# EasyEDA Pro project 第二版-FD6288Q-V1.0.epro, schematic Schematic1
Board Name: Board1; Create Date: 2025-09-24; Page Name: P1; Project Name: FOC第二版-FD6288Q-V1.0; Schematic Name: Schematic1; Update Date: 2025-09-27; BladeWidth: 10; Company: 嘉立创EDA; Page Size: A4; RegionStart: 1; ShowBorder: 1; TitleBlock: 1; TitleBlockPosition: 3; Version: V1.0; XRegionCount: 6; YRegionCount: 4
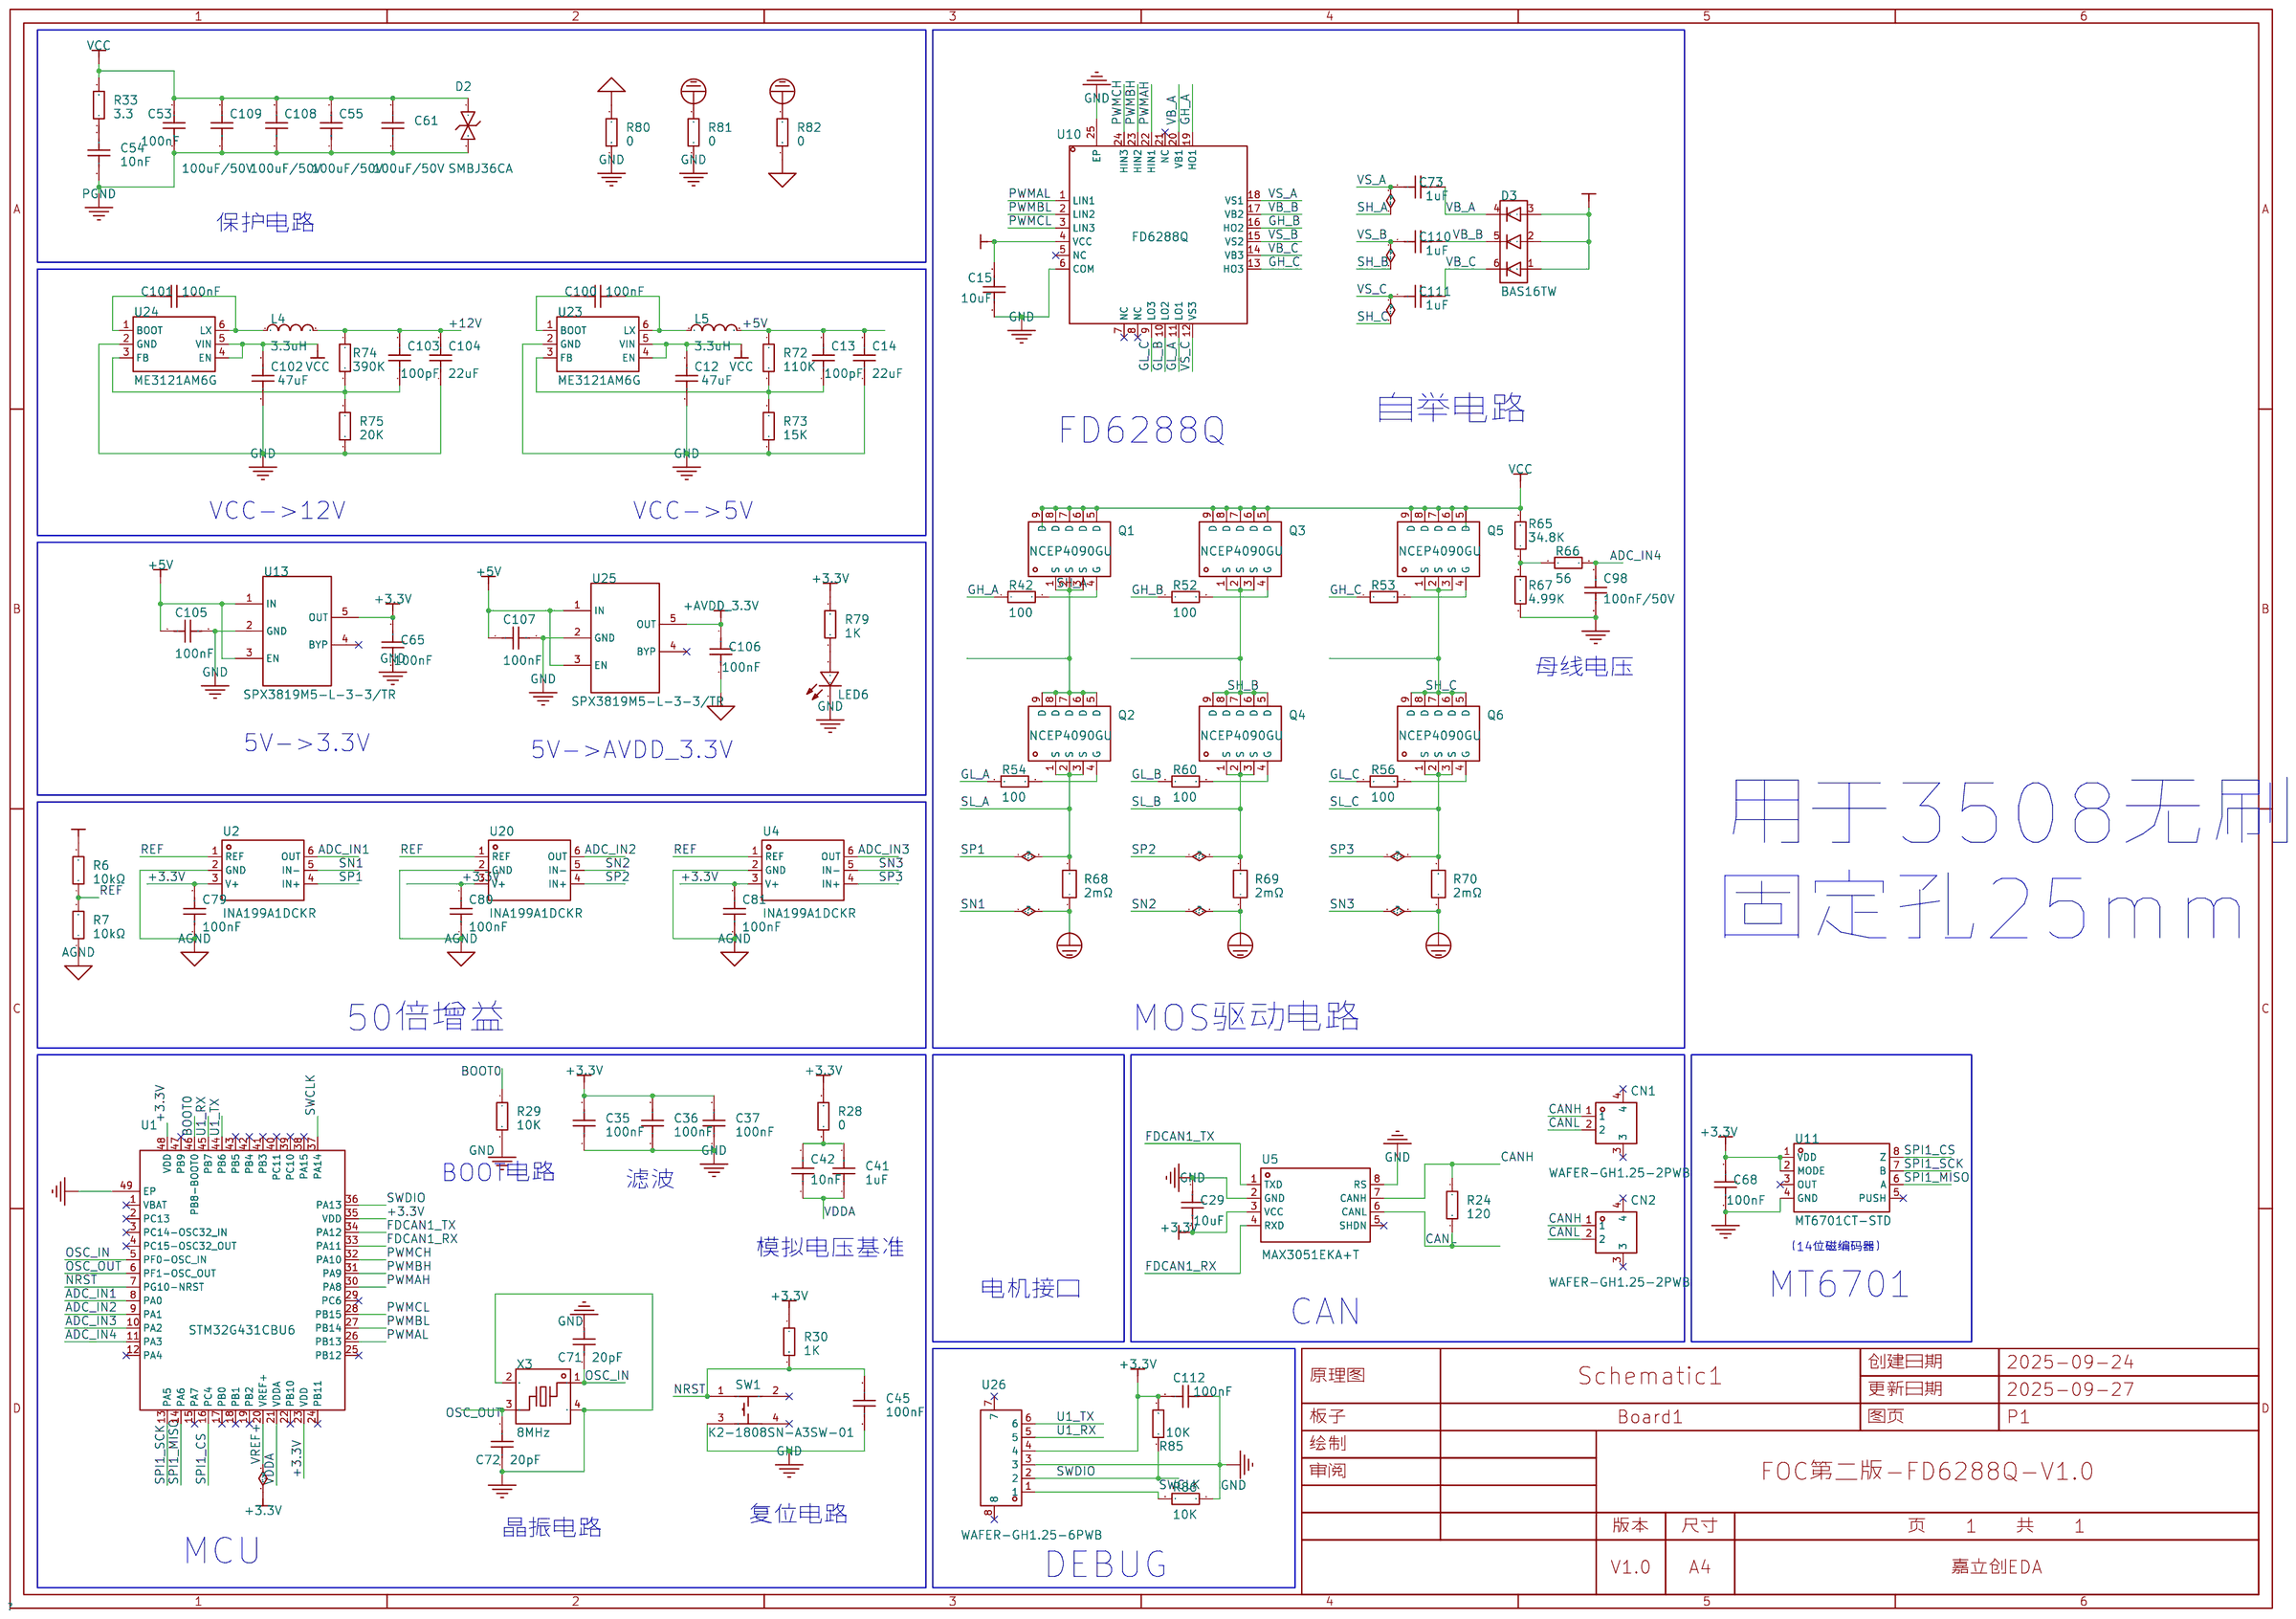
[diagram p0: schematic sheet]

## Parts
C12  47uF  [C1206]
C13  100pF  [C0603]
C14  22uF  [C0805]
C15  10uF  [C0603]
C29  10uF  [C0603]
C35  100nF  [C0603]
C36  100nF  [C0603]
C37  100nF  [C0603]
C41  1uF  [C0603]
C42  10nF  [C0603]
C45  100nF  [C0603]
C53  100nF  [C0603]
C54  10nF  [C0603]
C55  100uF/50V  [C1206]
C61  100uF/50V  [C1206]
C65  100nF  [C0603]
C68  100nF  [C0603]
C71  20pF  [C0603]
C72  20pF  [C0603]
C73  1uF  [C0603]
C79  100nF  [C0603]
C80  100nF  [C0603]
C81  100nF  [C0603]
C98  100nF/50V  [C0603]
C100  100nF  [C0603]
C101  100nF  [C0603]
C102  47uF  [C1206]
C103  100pF  [C0603]
C104  22uF  [C0805]
C105  100nF  [C0603]
C106  100nF  [C0603]
C107  100nF  [C0603]
C108  100uF/50V  [C1206]
C109  100uF/50V  [C1206]
C110  1uF  [C0603]
C111  1uF  [C0603]
C112  100nF  [C0603]
CN1  WAFER-GH1.25-2PWB  [CONN-TH_2P-P1.25_XUNPU_WAFER-GH1.25-2PWB]
CN2  WAFER-GH1.25-2PWB  [CONN-TH_2P-P1.25_XUNPU_WAFER-GH1.25-2PWB]
D2  SMBJ36CA  [SMB_L4.4-W3.6-LS5.3-BI]
D3  BAS16TW  [SOT-363_L2.1-W1.3-P0.65-LS2.3-BL]
L4  3.3uH  [IND-SMD_L4.4-W4.2-A]
L5  3.3uH  [IND-SMD_L4.4-W4.2-A]
LED6  KT-0603R  [LED0603-RD]
Q1  NCEP4090GU  [PDFN-8_L5.8-W5.1-P1.27-LS6.1-BL]
Q2  NCEP4090GU  [PDFN-8_L5.8-W5.1-P1.27-LS6.1-BL]
Q3  NCEP4090GU  [PDFN-8_L5.8-W5.1-P1.27-LS6.1-BL]
Q4  NCEP4090GU  [PDFN-8_L5.8-W5.1-P1.27-LS6.1-BL]
Q5  NCEP4090GU  [PDFN-8_L5.8-W5.1-P1.27-LS6.1-BL]
Q6  NCEP4090GU  [PDFN-8_L5.8-W5.1-P1.27-LS6.1-BL]
R6  10kΩ  [R0603]
R7  10kΩ  [R0603]
R24  120  [R0603]
R28  0  [R0603]
R29  10K  [R0603]
R30  1K  [R0603]
R33  3.3  [R0603]
R42  100  [R0603]
R52  100  [R0603]
R53  100  [R0603]
R54  100  [R0603]
R56  100  [R0603]
R60  100  [R0603]
R65  34.8K  [R0603]
R66  56  [R0603]
R67  4.99K  [R0603]
R68  2mΩ  [R1206]
R69  2mΩ  [R1206]
R70  2mΩ  [R1206]
R72  110K  [R0603]
R73  15K  [R0603]
R74  390K  [R0603]
R75  20K  [R0603]
R79  1K  [R0603]
R80  0  [R0603]
R81  0  [R0603]
R82  0  [R0603]
R85  10K  [R0603]
R86  10K  [R0603]
SW1  K2-1808SN-A3SW-01  [SW-SMD_4P-L4.2-W3.3-P2.15-LS5.1]
U1  STM32G431CBU6  [VQFN-48_L7.0-W7.0-P0.50-BL-EP5.5]
U2  INA199A1DCKR  [SC-70-6_L2.2-W1.3-P0.65-LS2.1-BR]
U4  INA199A1DCKR  [SC-70-6_L2.2-W1.3-P0.65-LS2.1-BR]
U5  MAX3051EKA+T  [SOT-23-8_L3.0-W1.7-P0.65-LS2.8-TL]
U10  FD6288Q  [QFN-24_L4.0-W4.0-P0.50-BL-EP2.6]
U11  MT6701CT-STD  [SOP-8_L4.9-W3.9-P1.27-LS6.0-BL]
U13  SPX3819M5-L-3-3/TR  [SOT-23-5_L3.0-W1.7-P0.95-LS2.8-BL]
U20  INA199A1DCKR  [SC-70-6_L2.2-W1.3-P0.65-LS2.1-BR]
U23  ME3121AM6G  [SOT-23-6_L2.9-W1.6-P0.95-LS2.8-BR]
U24  ME3121AM6G  [SOT-23-6_L2.9-W1.6-P0.95-LS2.8-BR]
U25  SPX3819M5-L-3-3/TR  [SOT-23-5_L3.0-W1.7-P0.95-LS2.8-BL]
U26  WAFER-GH1.25-6PWB  [CONN-SMD_6P-P1.25_XUNPU_WAFER-GH1.25-6PWB]
X3  8MHz  [CRYSTAL-SMD_4P-L3.2-W2.5-BL]

## Library data of the parts
C12 C55 C61 C102 C108 C109 = CAP_1206: Supplier Footprint: 1206
C13 C15 C29 C35-C37 C41 C42 C45 C53 C54 C65 C68 C71-C73 C79-C81 C98 C100 C101 C103 C105-C107 C110-C112 = CAP_0603: Supplier Footprint: 0603
C14 C104 = CAP_0805: Supplier Footprint: 0805
CN1 CN2 = WAFER-GH1.25-2PWB: 插针结构:1x2P;间距:1.25mm;安装方式:卧贴;参考系列:GH;总PIN数:2P;排数:1;每排PIN数:2;行距:-;额定电流:1A;触头材质:黄铜;触头镀层:锡;工作温度:-25℃~+85℃;; LCSC Part Name: 1x2P 间距:1.25mm 卧贴 系列:GH; Supplier Part: C3029377; Manufacturer: XUNPU(讯普); Supplier Footprint: SMD,P=1.25mm,卧贴; JLCPCB Part Class: 扩展库; Datasheet: https://item.szlcsc.com/datasheet/WAFER-GH1.25-2PWB/3561389.html; Supplier: LCSC; Pins Structure: 1x2P; Pitch: 1.25mm; Mounting Type: 卧贴; Reference Series: GH; Number of Pins: 2P; Number of Rows: 1; Number of PINs Per Row: 2; Current Rating: 1A; Contact Material: 黄铜; Contact Plating: 锡; Operating Temperature: -25℃~+85℃; Voltage Rating: 125V; Plastic Material: LCP; Supplementary Features: 辅助焊脚; Color: 米色; Z-Height of the Board: 4.35mm; X-Length of Bottom Edge on Board (Spacing Line): 5.75mm; Y-Width of Bottom Edge on Board: 5mm
D2 = SMBJ36CA_C726875: 极性：双向 反向截止电压(Vrwm)：36V 击穿电压：40V 最大钳位电压：58.1V; Supplier Part: C726875; Manufacturer: TWGMC(台湾迪嘉); Supplier Footprint: SMB; JLCPCB Part Class: 扩展库; Datasheet: https://atta.szlcsc.com/upload/public/pdf/source/20200901/C726811_07201DC3516E92FF13903A0BAE18F725.pdf; Supplier: LCSC
D3 = BAS16TW: 二极管配置:3个独立式;正向压降(Vf):1.25V@150mA;直流反向耐压(Vr):75V;整流电流:150mA;反向恢复时间(trr):4ns;; LCSC Part Name: 电压:75V 电流:150mA; Supplier Part: C68955; Manufacturer: CJ(江苏长电/长晶); Supplier Footprint: SOT-363; JLCPCB Part Class: 扩展库; Datasheet: https://atta.szlcsc.com/upload/public/pdf/source/20160516/1463363918721.pdf; Supplier: LCSC; Diode Configuration: 3个独立式; Forward Voltage (Vf@If): 1.25V@150mA; Reverse Voltage (Vr): 75V; Rectified Current: 150mA; Reverse Leakage Current: 1uA@75V; Reverse Recovery Time (trr): 4ns
L4 L5 = FXL0420-3R3-M: 电感值:3.3uH;精度:±20%;额定电流:3.3A;饱和电流(Isat):4A;类型:一体成型电感;; LCSC Part Name: 3.3uH ±20% 4A; Supplier Part: C167207; Manufacturer: cjiang(长江微电); Supplier Footprint: SMD,4.4x4.2mm; JLCPCB Part Class: 扩展库; Datasheet: https://item.szlcsc.com/datasheet/FXL0420-3R3-M/178590.html; Supplier: LCSC; Tolerance: ±20%; Current Rating: 3.3A; Current - Saturation(Isat): 4A; DC Resistance(DCR): 87mΩ; Type: 一体成型电感
LED6 = KT-0603R: 发光颜色:红色;功率:-;正向电流:-;主波长:-;二极管配置:-;透镜颜色:-;色温:-;发光角度:-;载带方式:-;工作温度:-40℃~+85℃;; LCSC Part Name: 0603 红灯 高亮; Supplier Part: C2286; Manufacturer: KENTO; Supplier Footprint: 0603; JLCPCB Part Class: 基础库; Datasheet: https://atta.szlcsc.com/upload/public/pdf/source/20160616/1466072038404.pdf; Supplier: LCSC; Emitted Color: 红色; Operating Temperature: -40℃~+85℃
Q1-Q6 = NCEP4090GU: 类型:1个N沟道;漏源电压(Vdss):40V;连续漏极电流(Id):90A;导通电阻(RDS(on)@Vgs,Id):2.2mΩ@10V,20A;功率:34W;阈值电压(Vgs(th)@Id):1.5V@250uA;; LCSC Part Name: 1个N沟道 耐压:40V 电流:90A; Supplier Part: C502976; Manufacturer: NCE(无锡新洁能); Supplier Footprint: PDFN-8(5.1x5.8); JLCPCB Part Class: 扩展库; Datasheet: https://atta.szlcsc.com/upload/public/pdf/source/20220527/503A5DACCB80AF3F7DC57D53F14F52A5.pdf; Supplier: LCSC; Type: 1个N沟道; Drain Source Voltage (Vdss): 40V; Continuous Drain Current (Id): 90A; Drain Source On Resistance (RDS(on)@Vgs,Id): 2.2mΩ@10V,20A; Power Dissipation (Pd): 34W; Gate Threshold Voltage (Vgs(th)@Id): 1.5V@250uA; Total Gate Charge (Qg@Vgs): 40nC@20V; Input Capacitance (Ciss@Vds): 2.3nF@20V; Reverse Transfer Capacitance (Crss@Vds): 38pF; Operating Temperature: -55℃~+150℃
R6 R7 = 0603WAF1001T5E: 电阻类型:厚膜电阻;阻值:1kΩ;精度:±1%;功率:100mW;最大工作电压:75V;温度系数:±100ppm/℃;; LCSC Part Name: 1kΩ ±1% 100mW 厚膜电阻; Supplier Part: C21190; Manufacturer: UNI-ROYAL(厚声); Supplier Footprint: 0603; JLCPCB Part Class: 基础库; Datasheet: https://atta.szlcsc.com/upload/public/pdf/source/20200306/C422600_1E6D84923E4A46A82E41ADD87F860B5C.pdf; Supplier: LCSC; Type: 厚膜电阻; Tolerance: ±1%; Power(Watts): 100mW; Overload Voltage (Max): 75V; Temperature Coefficient: ±100ppm/℃; Operating Temperature Range: -55℃~+155℃
R24 R28-R30 R33 R42 R52-R54 R56 R60 R65-R67 R72-R75 R79-R82 R85 R86 = Res_0603: Supplier Footprint: 0603
R68-R70 = HoJLR1206-1W-2mR-1%: 电阻类型:采样电阻;阻值:2mΩ;精度:±1%;功率:1W;安装方式:贴片;; LCSC Part Name: 2mΩ ±1% 1W; Supplier Part: C2904210; Manufacturer: Milliohm(毫欧); Supplier Footprint: 1206; JLCPCB Part Class: 扩展库; Datasheet: https://atta.szlcsc.com/upload/public/pdf/source/20211122/59F6674D1588D46FBBACD90BE2B15C8F.pdf; Supplier: LCSC; Type: 采样电阻; Tolerance: ±1%; Power(Watts): 1W; Mounting Type: 贴片
SW1 = K2-1808SN-A3SW-01: 触点电流:50mA;额定电压(DC):12V;绝缘电阻:100MΩ;安装方式:立贴;作用力:180gf@±30gf;机械寿命:100000;工作温度:-25℃~+85℃;开关长度:4.2mm;开关宽度:3.25mm;开关高度:2.5mm;; LCSC Part Name: 3*4*2.5 贴片开关180G; Supplier Part: C2690012; Manufacturer: 韩国韩荣; Supplier Footprint: SMD; JLCPCB Part Class: 扩展库; Datasheet: https://atta.szlcsc.com/upload/public/pdf/source/20180927/C283535_7E7907F3E7B6C1691E1DC87E363D082A.pdf; Supplier: LCSC; Contact Current: 50mA; Voltage Rating (DC): 12V; Insulation Resistance: 100MΩ; Mounting Sytle: 立贴; Operating Force: 180gf@±30gf; Mechanical Life: 100000; Operating Temperature: -25℃~+85℃; Switch Length: 4.2mm; Switch Width: 3.25mm; Switch Height: 2.5mm
U1 = STM32G431CBU6: CPU内核:ARM-M系列;CPU最大主频:170MHz;应用领域:-;; LCSC Part Name: 带DSP和FPU的170MHz主流ARM Cortex-M4 MCU，具有128 KB Flash存储器、数学加速器和中等模拟电平集成; Supplier Part: C529356; Manufacturer: ST(意法半导体); Supplier Footprint: UFQFPN-48(7x7); JLCPCB Part Class: 扩展库; Datasheet: https://atta.szlcsc.com/upload/public/pdf/source/20200511/C529354_7C66CF00837B904D0C15DCE45B69418C.pdf; Supplier: LCSC; CPU Core: ARM-M系列; CPU Maximum Speed: 170MHz; Program Storage Size: 128KB; Program Memory Type: FLASH; Number of I/O: 42; ADC (Bit): 12bit; DAC (Bit): 12bit; Low Voltage Detection Threshold: 1.71V~3.6V
U2 U4 U20 = INA199A1DCKR: INA199 26V、双向电流感应放大器; Supplier Part: C59135; Manufacturer: TI(德州仪器); Supplier Footprint: SOT-363(SC-70-6); JLCPCB Part Class: 扩展库; Datasheet: https://www.ti.com/cn/lit/gpn/ina199; Supplier: LCSC; Supply Voltage: -300mV~26V; Supply Current: 300uA; Operating Temperature: -40℃~+125℃
U5 = MAX3051EKA+T: 类型:收发器;数据速率:1Mbps;; LCSC Part Name: 1Mbps 3.14V~3.47V; Supplier Part: C112005; Manufacturer: ADI(亚德诺); Supplier Footprint: SOT-23-8; JLCPCB Part Class: 扩展库; Datasheet: https://atta.szlcsc.com/upload/public/pdf/source/20171014/C112005_15079752662991037925.pdf; Supplier: LCSC; Type: 收发器; Data Rate: 1Mbps; Supply Voltage: 3.14V~3.47V
U10 = FD6288Q: Supplier Part: C328453; Manufacturer: Fortior Tech(峰岹); Supplier Footprint: QFN-24-EP(4x4); JLCPCB Part Class: 扩展库; Datasheet: https://atta.szlcsc.com/upload/public/pdf/source/20241101/0E2856EB301EAFFED732065FB088D773.pdf; Supplier: LCSC
U11 = MT6701CT-STD_C5451785: Supplier Part: C5451785; Manufacturer: MagnTek(麦歌恩); Supplier Footprint: SOP-8; JLCPCB Part Class: 扩展库; Datasheet: https://atta.szlcsc.com/upload/public/pdf/source/20240409/995E18415A669787D9A549675AADF1FD.pdf; Supplier: LCSC
U13 U25 = SPX3819M5-L-3-3/TR: 输出类型:固定;最大输入电压:16V;输出电压:3.3V;最大输出电流:500mA;电源纹波抑制比(PSRR):70dB;输出极性:正极;; LCSC Part Name: 输入16V 输出3.3V 500mA; Supplier Part: C9055; Manufacturer: MaxLinear(迈凌); Supplier Footprint: SOT-23-5; JLCPCB Part Class: 扩展库; Datasheet: https://atta.szlcsc.com/upload/public/pdf/source/20150720/1457707331934.pdf; Supplier: LCSC; Output Type: 固定; Maximum Input Voltage: 16V; Output Voltage: 3.3V; MAX Output Current: 500mA; Power Supply Rejection Ratio (PSRR): 70dB; Dropout Voltage: 700mV@(500mA); standby current: 8uA; Operating Temperature: -40℃~+125℃; Output Polarity: 正极; Number of Outputs: 1
U23 U24 = ME3121AM6G: 功能类型:降压型;输出类型:可调;工作电压:4.7V~40V;输出电压:-;输出电流:-;; LCSC Part Name: 40V输入1A负载同步整流降压DC-DC转换器; Supplier Part: C2932938; Manufacturer: MICRONE(南京微盟); Supplier Footprint: SOT-23-6; JLCPCB Part Class: 扩展库; Datasheet: https://atta.szlcsc.com/upload/public/pdf/source/20220331/EB46EBF6ED46F90696A7B4CB82ED1A1E.pdf; Supplier: LCSC; Function: 降压型; Output Type: 可调; Voltage - Supply: 4.7V~40V; Frequency - Switching: 1MHz; Operating Temperature: -40℃~+85℃; Synchronous Rectifier: 是; Number of Outputs: 1; Topology: 降压式; Quiescent Current: 120uA; Switch tube (built-in/external): 内置
U26 = WAFER-GH1.25-6PWB: 插针结构:1x6P;间距:1.25mm;安装方式:卧贴;参考系列:GH;总PIN数:6P;排数:1;每排PIN数:6;行距:-;额定电流:1A;触头材质:黄铜;触头镀层:锡;工作温度:-25℃~+85℃;; LCSC Part Name: 1x6P 间距:1.25mm 卧贴 系列:GH; Supplier Part: C3029381; Manufacturer: XUNPU(讯普); Supplier Footprint: SMD,P=1.25mm,卧贴; JLCPCB Part Class: 扩展库; Datasheet: https://item.szlcsc.com/datasheet/WAFER-GH1.25-6PWB/3561393.html; Supplier: LCSC; Pins Structure: 1x6P; Pitch: 1.25mm; Mounting Type: 卧贴; Reference Series: GH; Number of Pins: 6P; Number of Rows: 1; Number of PINs Per Row: 6; Current Rating: 1A; Contact Material: 黄铜; Contact Plating: 锡; Operating Temperature: -25℃~+85℃; Voltage Rating: 125V; Plastic Material: LCP; Supplementary Features: 辅助焊脚; Color: 米色; Z-Height of the Board: 4.35mm; X-Length of Bottom Edge on Board (Spacing Line): 10.75mm; Y-Width of Bottom Edge on Board: 5mm
X3 = X32258MSB4SI: 晶振类型:贴片晶振;频率:8MHz;常温频差:±10ppm;外接负载电容:20pF;频率稳定度(全温):±20ppm;; LCSC Part Name: 8MHz ±10ppm 20pF; Supplier Part: C2682774; Manufacturer: YXC(扬兴晶振); Supplier Footprint: SMD3225-4P; JLCPCB Part Class: 扩展库; Datasheet: https://atta.szlcsc.com/upload/public/pdf/source/20240329/19D5F850207469550BEB00D7DFEDBC7A.pdf; Supplier: LCSC; Crystal Type: 贴片晶振; Normal temperature Frequency Tolerance: ±10ppm; External load capacitor: 20pF; Frequency Stability(Full temperature range): ±20ppm; Operating Temperature: -40℃~+85℃

## Nets
+3.3V: C29.2 C35.2 C36.2 C37.2 C65.1 C68.1 C79.2 C80.2 C81.2 C112.2 R28.2 R30.1 R79.1 R85.2 U1.20(VREF+) U1.23(VDD) U1.35(VDD) U1.48(VDD) U2.3(V+) U4.3(V+) U5.3(VCC) U11.1(VDD) U11.2(MODE) U13.5(OUT) U20.3(V+) U26.4
+5V: C13.2 C14.2 C105.1 C107.1 L5.2 R72.1 U13.1(IN) U13.3(EN) U25.1(IN) U25.3(EN)
+12V: C15.2 C103.2 C104.2 D3.1(A) D3.2(A) D3.3(A) L4.2 R74.1 U10.4(VCC)
+AVDD_3.3V: C106.1 R6.2 U25.5(OUT)
AGND: C79.1 C80.1 C81.1 C106.2 R7.1 R80.2 R82.1 U2.2(GND) U4.2(GND) U20.2(GND)
GND: C12.1 C14.1 C15.1 C29.1 C35.1 C36.1 C37.1 C45.2 C65.2 C68.2 C71.1 C72.1 C98.2 C102.1 C104.1 C105.2 C107.2 C112.1 LED6.1(K) R29.2 R67.1 R73.1 R75.1 R80.1 R81.1 R86.1 SW1.3 U1.49(EP) U5.2(GND) U5.8(RS) U10.6(COM) U10.25(EP) U11.4(GND) U13.2(GND) U23.2(GND) U24.2(GND) U25.2(GND) U26.3 X3.2(GND) X3.4(GND)
PGND: C53.2 C54.2 C55.1 C61.1 C108.1 C109.1 D2.2 R68.1 R69.1 R70.1 R81.2 R82.2 U2.5(IN-) U4.5(IN-) U20.5(IN-)
VCC: C12.2 C53.1 C55.2 C61.2 C102.2 C108.2 C109.2 D2.1 Q1.5(D) Q1.6(D) Q1.7(D) Q1.8(D) Q1.9(D) Q3.5(D) Q3.6(D) Q3.7(D) Q3.8(D) Q3.9(D) Q5.5(D) Q5.6(D) Q5.7(D) Q5.8(D) Q5.9(D) R33.2 R65.2 U23.4(EN) U23.5(VIN) U24.4(EN) U24.5(VIN)
VDDA: C41.1 C42.1 U1.21(VDDA)
ADC_IN1: U1.8(PA0) U2.6(OUT)
ADC_IN2: U1.9(PA1) U20.6(OUT)
ADC_IN3: U1.10(PA2) U4.6(OUT)
ADC_IN4: C98.1 R66.2 U1.11(PA3)
BOOT0: R29.1 U1.46(PB8-BOOT0)
CANH: CN1.1 CN2.1 R24.1 U5.7(CANH)
CANL: CN1.2 CN2.2 R24.2 U5.6(CANL)
FDCAN1_RX: U1.33(PA11) U5.4(RXD)
FDCAN1_TX: U1.34(PA12) U5.1(TXD)
GH_A: R42.1 U10.19(HO1)
GH_B: R52.1 U10.16(HO2)
GH_C: R53.1 U10.13(HO3)
GL_A: R54.1 U10.11(LO1)
GL_B: R60.1 U10.10(LO2)
GL_C: R56.1 U10.9(LO3)
NRST: C45.1 R30.2 SW1.1 U1.7(PG10-NRST)
OSC_IN: C71.2 U1.5(PF0-OSC_IN) X3.1
OSC_OUT: C72.2 U1.6(PF1-OSC_OUT) X3.3
PWMAH: U1.30(PA8) U10.22(HIN1)
PWMAL: U1.26(PB13) U10.1(LIN1)
PWMBH: U1.31(PA9) U10.23(HIN2)
PWMBL: U1.27(PB14) U10.2(LIN2)
PWMCH: U1.32(PA10) U10.24(HIN3)
PWMCL: U1.28(PB15) U10.3(LIN3)
REF: R6.1 R7.2 U2.1(REF) U4.1(REF) U20.1(REF)
SH_A: C73.1 Q1.1(S) Q1.2(S) Q1.3(S) Q2.5(D) Q2.6(D) Q2.7(D) Q2.8(D) Q2.9(D) U10.18(VS1)
SH_B: C110.1 Q3.1(S) Q3.2(S) Q3.3(S) Q4.5(D) Q4.6(D) Q4.7(D) Q4.8(D) Q4.9(D) U10.15(VS2)
SH_C: C111.1 Q5.1(S) Q5.2(S) Q5.3(S) Q6.5(D) Q6.6(D) Q6.7(D) Q6.8(D) Q6.9(D) U10.12(VS3)
SL_A: Q2.1(S) Q2.2(S) Q2.3(S) R68.2 U2.4(IN+)
SL_B: Q4.1(S) Q4.2(S) Q4.3(S) R69.2 U20.4(IN+)
SL_C: Q6.1(S) Q6.2(S) Q6.3(S) R70.2 U4.4(IN+)
SPI1_CS: U1.16(PC4) U11.8(Z)
SPI1_MISO: U1.14(PA6) U11.6(A)
SPI1_SCK: U1.13(PA5) U11.7(B)
SWCLK: R86.2 U1.37(PA14) U26.1
SWDIO: R85.1 U1.36(PA13) U26.2
U1_RX: U1.45(PB7) U26.5
U1_TX: U1.44(PB6) U26.6
VB_A: C73.2 D3.4(K) U10.20(VB1)
VB_B: C110.2 D3.5(K) U10.17(VB2)
VB_C: C111.2 D3.6(K) U10.14(VB3)
$1N1343: Q3.4(G) R52.2
$1N1357: Q4.4(G) R60.2
$1N1370: Q6.4(G) R56.2
$1N1373: Q5.4(G) R53.2
$1N1378: R65.1 R66.1 R67.2
$1N1392: Q2.4(G) R54.2
$1N3197: C100.1 U23.1(BOOT)
$1N3251: C100.2 L5.1 U23.6(LX)
$1N3439: C13.1 R72.2 R73.2 U23.3(FB)
$1N4098: C101.2 L4.1 U24.6(LX)
$1N4103: C103.1 R74.2 R75.2 U24.3(FB)
$1N4119: C101.1 U24.1(BOOT)
$1N4748: LED6.2(A) R79.2
$1N5944: C41.2 C42.2 R28.1
$1N6352: C54.1 R33.1
$1N11617: Q1.4(G) R42.2

Not connected (* = marked no-connect by the designer): CN1 3* 4*; CN2 3* 4*; SW1 2* 4*; U1 1(VBAT)* 2(PC13)* 3(PC14-OSC32_IN)* 4(PC15-OSC32_OUT)* 12(PA4)* 15(PA7)* 17(PB0)* 18(PB1)* 19(PB2)* 22(PB10)* 24(PB11)* 25(PB12)* 29(PC6)* 38(PA15)* 39(PC10)* 40(PC11)* 41(PB3)* 42(PB4)* 43(PB5)* 47(PB9)*; U5 5(SHDN)*; U10 5(NC)* 7(NC)* 8(NC)* 21(NC)*; U11 3(OUT)* 5(PUSH)*; U13 4(BYP)*; U25 4(BYP)*; U26 7* 8*

## Notes on the sheet
- 保护电路
- 自举电路
- FD6288Q
- VCC->12V
- VCC->5V
- 母线电压
- 5V->3.3V
- 5V->AVDD_3.3V
- 用于3508无刷
  固定孔25mm
- 50倍增益
- MOS驱动电路
- BOOT电路
- 滤波
- 模拟电压基准
- （14位磁编码器）
- 电机接口
- MT6701
- CAN
- 复位电路
- 晶振电路
- MCU
- DEBUG
